# Altium project Single Teensy MD +interface+power@2025.PrjPcb
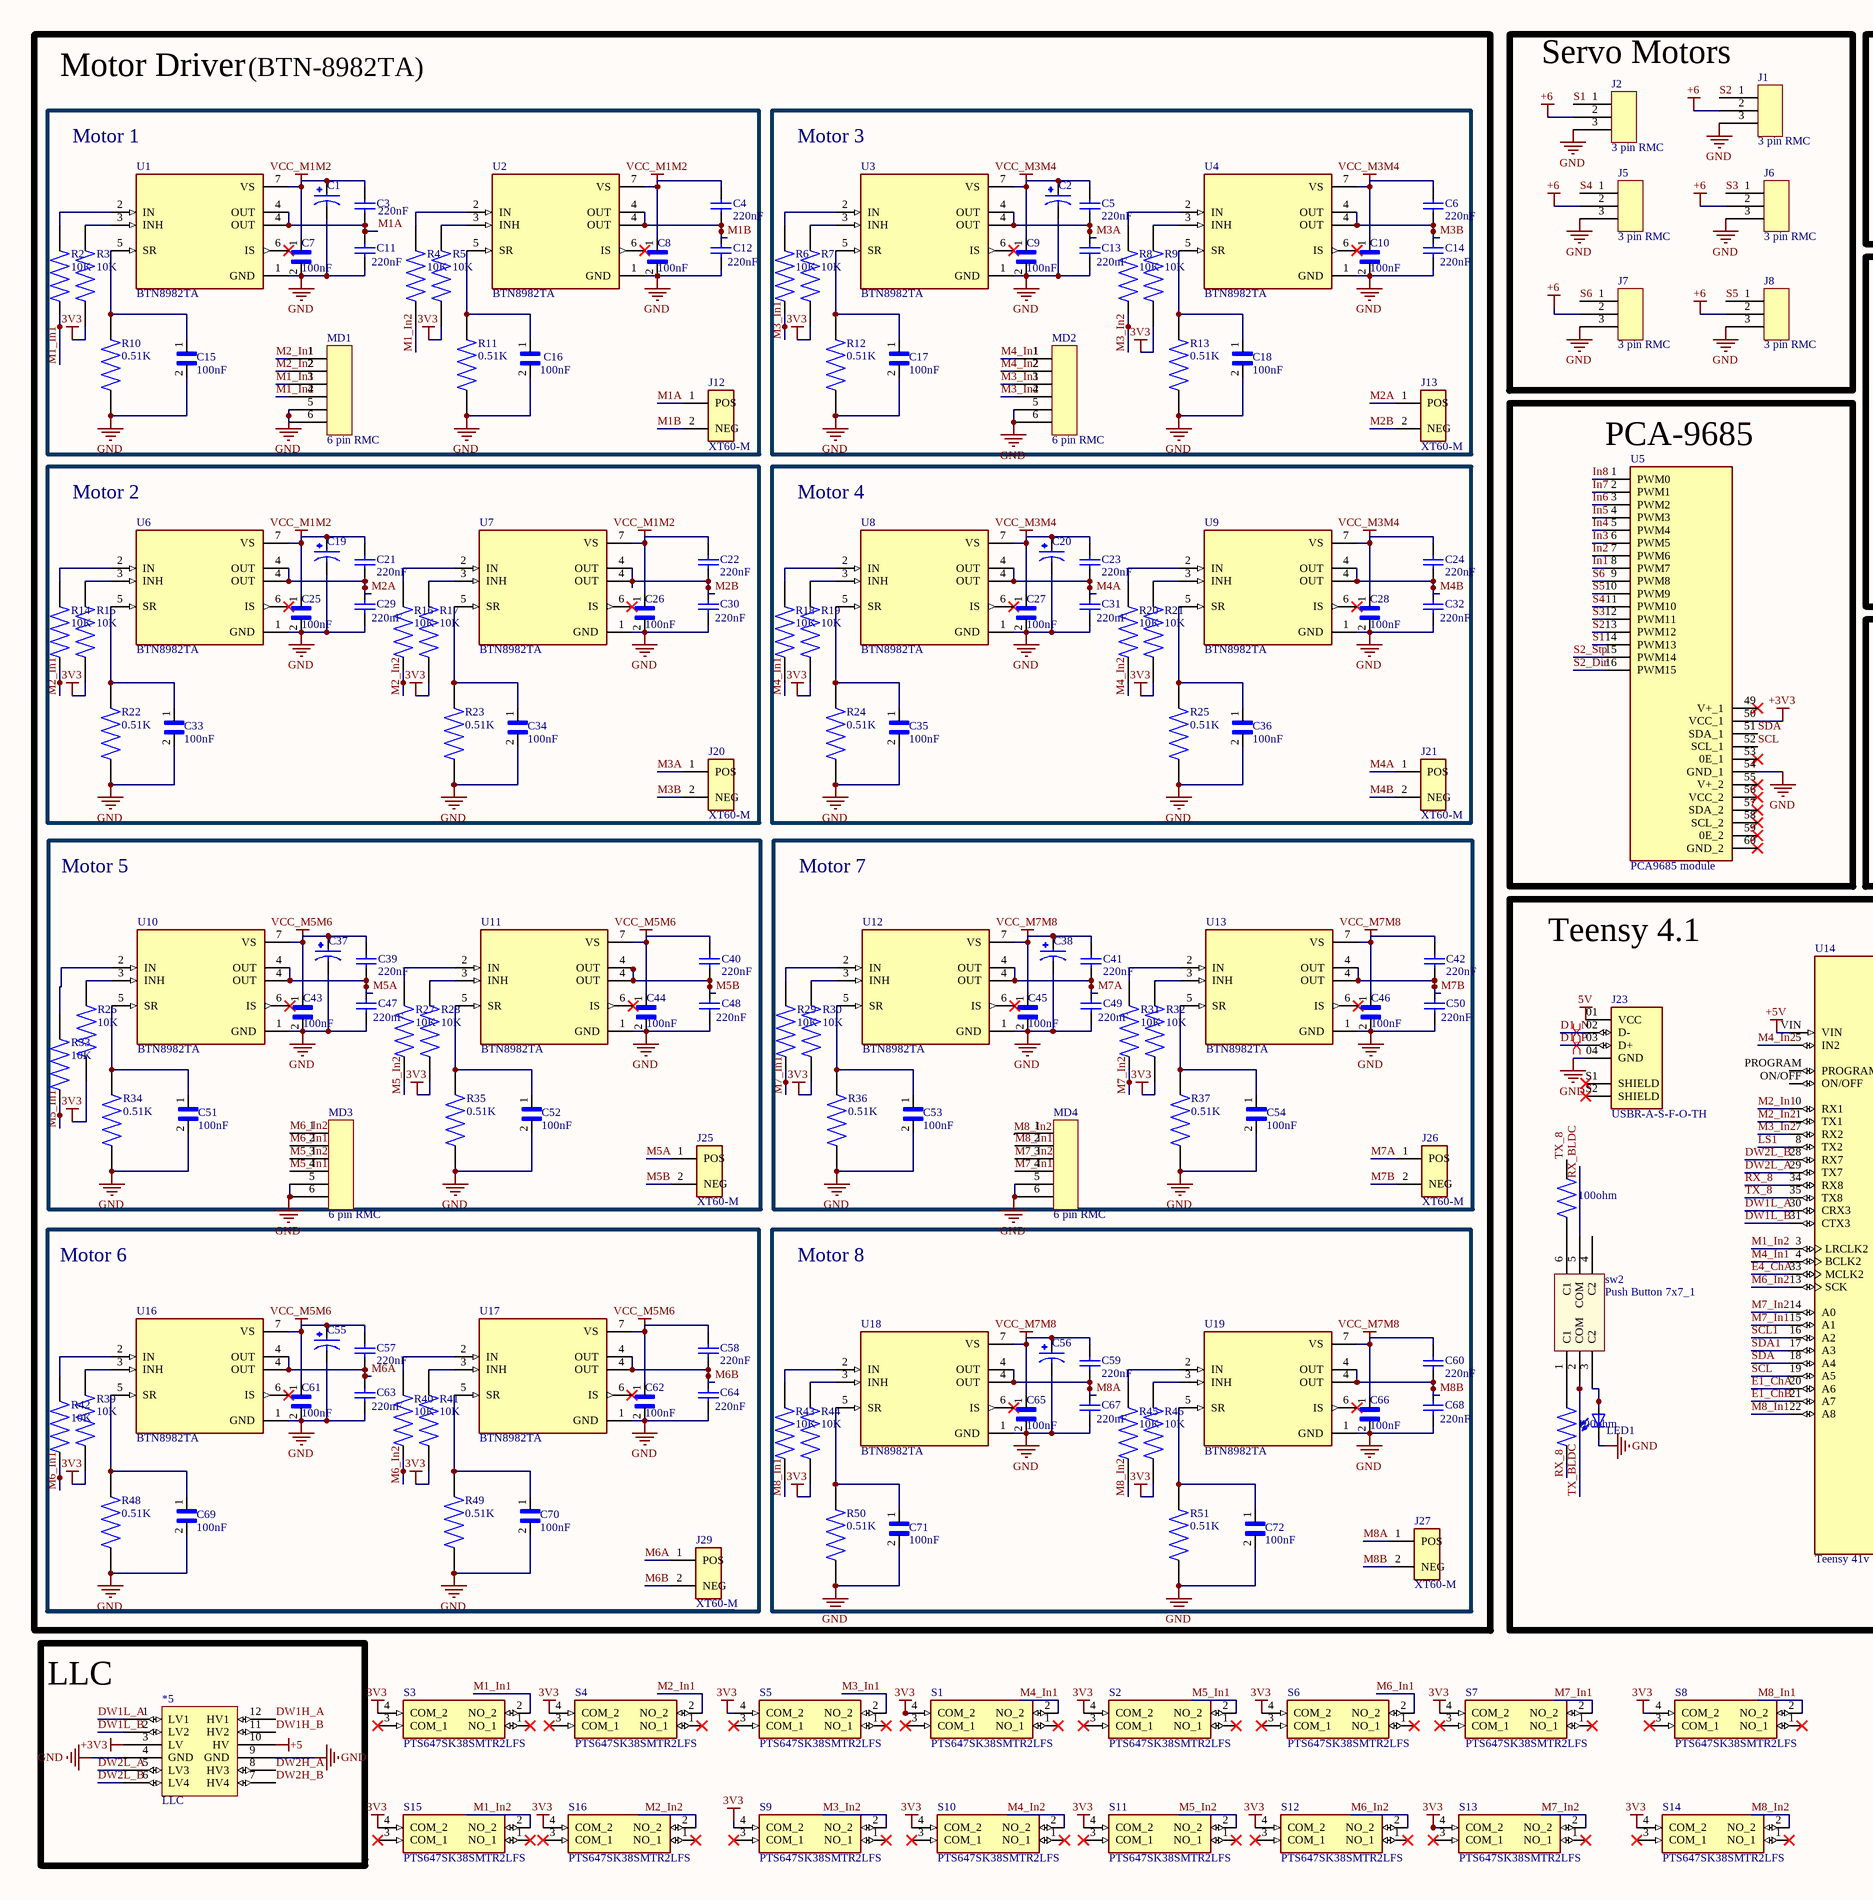
[diagram p0: Interface.SchDoc, left]
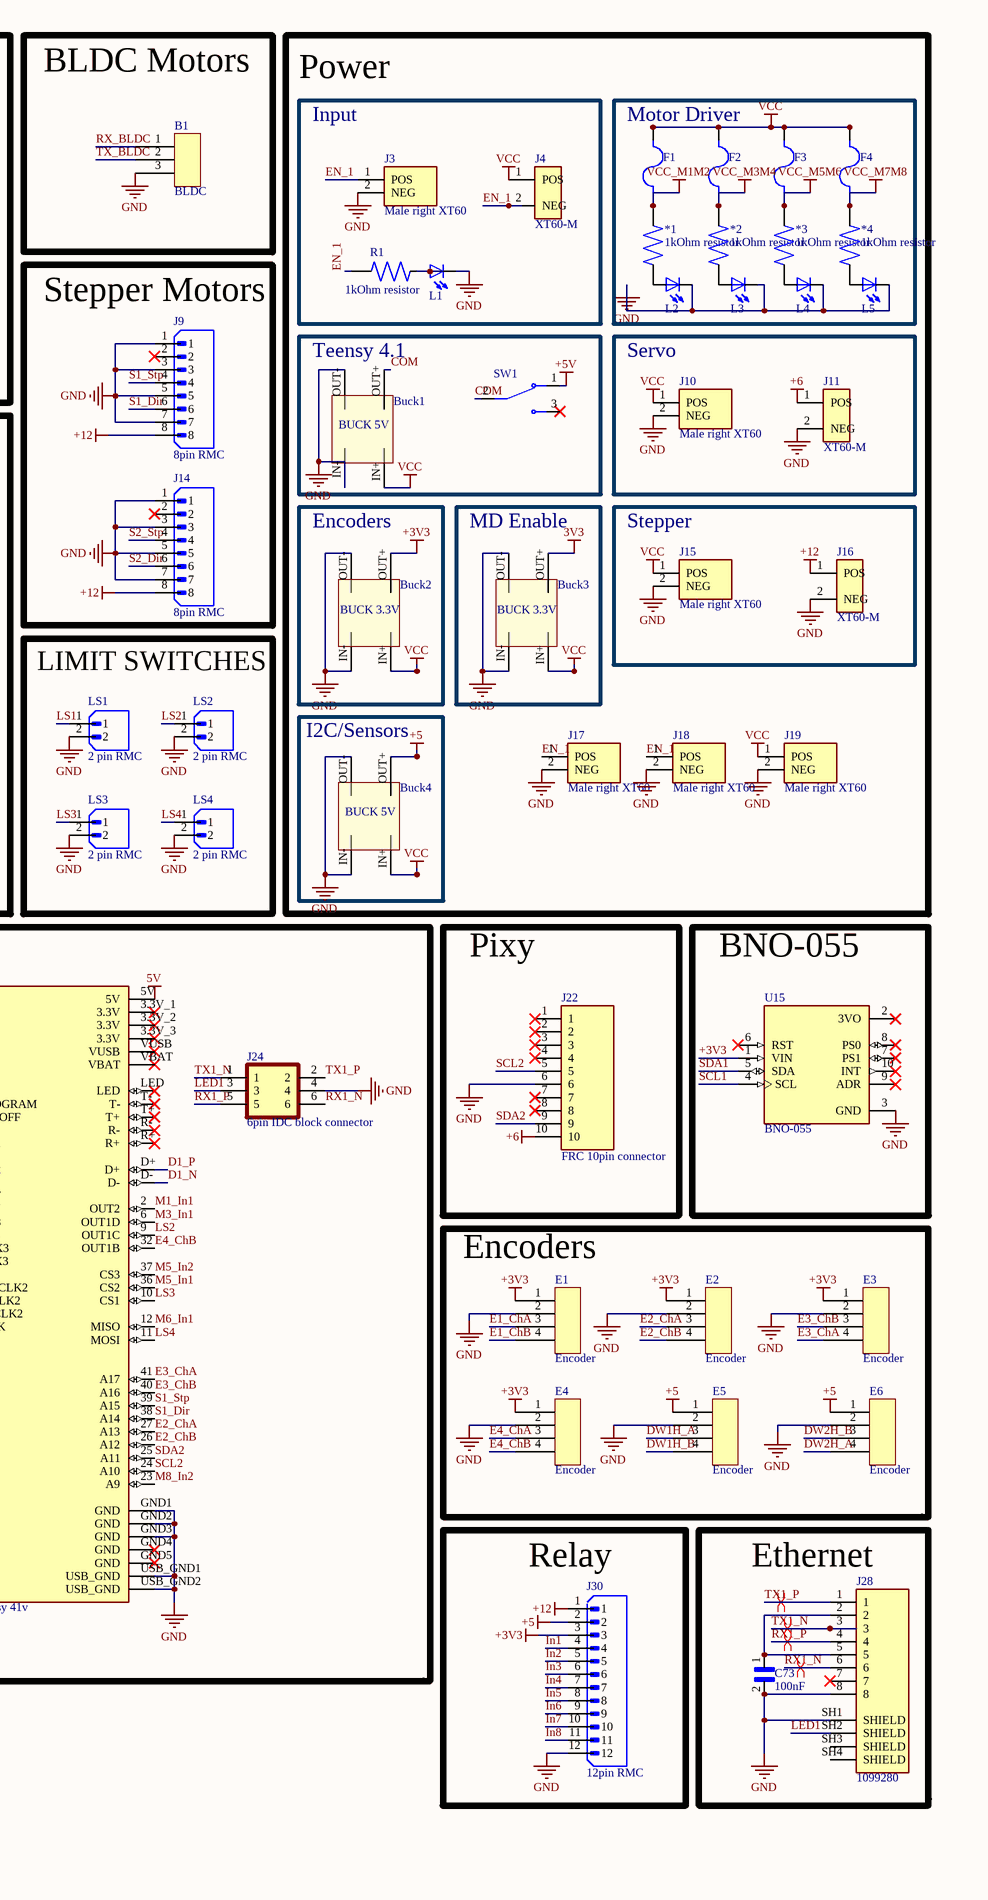
[diagram p1: Interface.SchDoc, right]
1 sheet, 225 parts. Net scope: global (net labels, ports and power ports of the same name join across sheets).
Board file: BOT1_2025.PcbDoc

## Sheet Interface.SchDoc: R1/R2 2025
size A2; Author: Mohammed; CompanyName: SRM Team Robocon; DrawnBy: Mohammed; SheetNumber: 1; SheetTotal: 1

### Parts
*1  1kOhm resistor  [1kOhm Resistor]
*2  1kOhm resistor  [1kOhm Resistor]
*3  1kOhm resistor  [1kOhm Resistor]
*4  1kOhm resistor  [1kOhm Resistor]
*5  LLC  [LLC]
B1  BLDC  [Header JST 1X03]
Buck1  CN3900 5V  [CN3903 Dubai buck 5V]  (value not drawn)
Buck2  CN3900 3.3V  [CN3903 Dubai buck 3.3V]  (value not drawn)
Buck3  CN3900 3.3V  [CN3903 Dubai buck 3.3V]  (value not drawn)
Buck4  CN3900 5V  [CN3903 Dubai buck 5V]  (value not drawn)
C1  1000uF 25V Capacitor  [1000uF 25V Capacitor]  (value not drawn)
C2  1000uF 25V Capacitor  [1000uF 25V Capacitor]  (value not drawn)
C3  220nF  [WCAP-CSST_0805_L2W1.25H1.25]
C4  220nF  [WCAP-CSST_0805_L2W1.25H1.25]
C5  220nF  [WCAP-CSST_0805_L2W1.25H1.25]
C6  220nF  [WCAP-CSST_0805_L2W1.25H1.25]
C7  100nF  [CAPC2012X88N]
C8  100nF  [CAPC2012X88N]
C9  100nF  [CAPC2012X88N]
C10  100nF  [CAPC2012X88N]
C11  220nF  [WCAP-CSST_0805_L2W1.25H1.25]
C12  220nF  [WCAP-CSST_0805_L2W1.25H1.25]
C13  220nF  [WCAP-CSST_0805_L2W1.25H1.25]
C14  220nF  [WCAP-CSST_0805_L2W1.25H1.25]
C15  100nF  [CAPC2012X88N]
C16  100nF  [CAPC2012X88N]
C17  100nF  [CAPC2012X88N]
C18  100nF  [CAPC2012X88N]
C19  1000uF 25V Capacitor  [1000uF 25V Capacitor]  (value not drawn)
C20  1000uF 25V Capacitor  [1000uF 25V Capacitor]  (value not drawn)
C21  220nF  [WCAP-CSST_0805_L2W1.25H1.25]
C22  220nF  [WCAP-CSST_0805_L2W1.25H1.25]
C23  220nF  [WCAP-CSST_0805_L2W1.25H1.25]
C24  220nF  [WCAP-CSST_0805_L2W1.25H1.25]
C25  100nF  [CAPC2012X88N]
C26  100nF  [CAPC2012X88N]
C27  100nF  [CAPC2012X88N]
C28  100nF  [CAPC2012X88N]
C29  220nF  [WCAP-CSST_0805_L2W1.25H1.25]
C30  220nF  [WCAP-CSST_0805_L2W1.25H1.25]
C31  220nF  [WCAP-CSST_0805_L2W1.25H1.25]
C32  220nF  [WCAP-CSST_0805_L2W1.25H1.25]
C33  100nF  [CAPC2012X88N]
C34  100nF  [CAPC2012X88N]
C35  100nF  [CAPC2012X88N]
C36  100nF  [CAPC2012X88N]
C37  1000uF 25V Capacitor  [1000uF 25V Capacitor]  (value not drawn)
C38  1000uF 25V Capacitor  [1000uF 25V Capacitor]  (value not drawn)
C39  220nF  [WCAP-CSST_0805_L2W1.25H1.25]
C40  220nF  [WCAP-CSST_0805_L2W1.25H1.25]
C41  220nF  [WCAP-CSST_0805_L2W1.25H1.25]
C42  220nF  [WCAP-CSST_0805_L2W1.25H1.25]
C43  100nF  [CAPC2012X88N]
C44  100nF  [CAPC2012X88N]
C45  100nF  [CAPC2012X88N]
C46  100nF  [CAPC2012X88N]
C47  220nF  [WCAP-CSST_0805_L2W1.25H1.25]
C48  220nF  [WCAP-CSST_0805_L2W1.25H1.25]
C49  220nF  [WCAP-CSST_0805_L2W1.25H1.25]
C50  220nF  [WCAP-CSST_0805_L2W1.25H1.25]
C51  100nF  [CAPC2012X88N]
C52  100nF  [CAPC2012X88N]
C53  100nF  [CAPC2012X88N]
C54  100nF  [CAPC2012X88N]
C55  1000uF 25V Capacitor  [1000uF 25V Capacitor]  (value not drawn)
C56  1000uF 25V Capacitor  [1000uF 25V Capacitor]  (value not drawn)
C57  220nF  [WCAP-CSST_0805_L2W1.25H1.25]
C58  220nF  [WCAP-CSST_0805_L2W1.25H1.25]
C59  220nF  [WCAP-CSST_0805_L2W1.25H1.25]
C60  220nF  [WCAP-CSST_0805_L2W1.25H1.25]
C61  100nF  [CAPC2012X88N]
C62  100nF  [CAPC2012X88N]
C63  220nF  [WCAP-CSST_0805_L2W1.25H1.25]
C64  220nF  [WCAP-CSST_0805_L2W1.25H1.25]
C65  100nF  [CAPC2012X88N]
C66  100nF  [CAPC2012X88N]
C67  220nF  [WCAP-CSST_0805_L2W1.25H1.25]
C68  220nF  [WCAP-CSST_0805_L2W1.25H1.25]
C69  100nF  [CAPC2012X88N]
C70  100nF  [CAPC2012X88N]
C71  100nF  [CAPC2012X88N]
C72  100nF  [CAPC2012X88N]
C73  100nF  [CAPC2012X88N]
E1  Encoder  [Header JST 1X04]
E2  Encoder  [Header JST 1X04]
E3  Encoder  [Header JST 1X04]
E4  Encoder  [Header JST 1X04]
E5  Encoder  [Header JST 1X04]
E6  Encoder  [Header JST 1X04]
F1  Blade Fuse Holder  [Blade fuse holder]  (value not drawn)
F2  Blade Fuse Holder  [Blade fuse holder]  (value not drawn)
F3  Blade Fuse Holder  [Blade fuse holder]  (value not drawn)
F4  Blade Fuse Holder  [Blade fuse holder]  (value not drawn)
J1  3 pin RMC  [Header JST 1X03]
J2  3 pin RMC  [Header JST 1X03]
J3  Male right XT60  [XT60M Right]
J4  XT60-M  [XT-60M]
J5  3 pin RMC  [Header JST 1X03]
J6  3 pin RMC  [Header JST 1X03]
J7  3 pin RMC  [Header JST 1X03]
J8  3 pin RMC  [Header JST 1X03]
J9  8pin RMC  [8pin RMC]
J10  Male right XT60  [XT60M Right]
J11  XT60-M  [XT60-M]
J12  XT60-M  [XT60-M]
J13  XT60-M  [XT60-M]
J14  8pin RMC  [8pin RMC]
J15  Male right XT60  [XT60M Right]
J16  XT60-M  [XT60-M]
J17  Male right XT60  [XT60M Right]
J18  Male right XT60  [XT60M Right]
J19  Male right XT60  [XT60M Right]
J20  XT60-M  [XT60-M]
J21  XT60-M  [XT60-M]
J22  FRC 10pin connector  [FRC 10pin Block connector]
J23  USBR-A-S-F-O-TH  [SAMTEC_USBR-A-S-F-O-TH]
J24  6pin IDC block connector  [6pin IDC block connector]
J25  XT60-M  [XT60-M]
J26  XT60-M  [XT60-M]
J27  XT60-M  [XT60-M]
J28  1099280  [PHOENIX_1099280]
J29  XT60-M  [XT60-M]
J30  12pin RMC  [Header JST 1X12]
L1  LED 3mm  [LED 3mm]  (value not drawn)
L2  LED 3mm  [LED 3mm]  (value not drawn)
L3  LED 3mm  [LED 3mm]  (value not drawn)
L4  LED 3mm  [LED 3mm]  (value not drawn)
L5  LED 3mm  [LED 3mm]  (value not drawn)
LED1  LED 3mm  [LED 3mm]  (value not drawn)
LS1  2 pin RMC  [JST 2 PIN]
LS2  2 pin RMC  [JST 2 PIN]
LS3  2 pin RMC  [JST 2 PIN]
LS4  2 pin RMC  [JST 2 PIN]
MD1  6 pin RMC  [HEADER JST 1X06]
MD2  6 pin RMC  [HEADER JST 1X06]
MD3  6 pin RMC  [HEADER JST 1X06]
MD4  6 pin RMC  [HEADER JST 1X06]
R1  1kOhm resistor  [1kOhm Resistor]
R2  10K  [RESC2012X65N]
R3  10K  [RESC2012X65N]
R4  10K  [RESC2012X65N]
R5  10K  [RESC2012X65N]
R6  10K  [RESC2012X65N]
R7  10K  [RESC2012X65N]
R8  10K  [RESC2012X65N]
R9  10K  [RESC2012X65N]
R10  0.51K  [RES_ERJHP6F5112V]
R11  0.51K  [RES_ERJHP6F5112V]
R12  0.51K  [RES_ERJHP6F5112V]
R13  0.51K  [RES_ERJHP6F5112V]
R14  10K  [RESC2012X65N]
R15  10K  [RESC2012X65N]
R16  10K  [RESC2012X65N]
R17  10K  [RESC2012X65N]
R18  10K  [RESC2012X65N]
R19  10K  [RESC2012X65N]
R20  10K  [RESC2012X65N]
R21  10K  [RESC2012X65N]
R22  0.51K  [RES_ERJHP6F5112V]
R23  0.51K  [RES_ERJHP6F5112V]
R24  0.51K  [RES_ERJHP6F5112V]
R25  0.51K  [RES_ERJHP6F5112V]
R26  10K  [RESC2012X65N]
R27  10K  [RESC2012X65N]
R28  10K  [RESC2012X65N]
R29  10K  [RESC2012X65N]
R30  10K  [RESC2012X65N]
R31  10K  [RESC2012X65N]
R32  10K  [RESC2012X65N]
R33  10K  [RESC2012X65N]
R34  0.51K  [RES_ERJHP6F5112V]
R35  0.51K  [RES_ERJHP6F5112V]
R36  0.51K  [RES_ERJHP6F5112V]
R37  0.51K  [RES_ERJHP6F5112V]
R38  100ohm  [1kOhm Resistor]
R39  10K  [RESC2012X65N]
R40  10K  [RESC2012X65N]
R41  10K  [RESC2012X65N]
R42  10K  [RESC2012X65N]
R43  10K  [RESC2012X65N]
R44  10K  [RESC2012X65N]
R45  10K  [RESC2012X65N]
R46  10K  [RESC2012X65N]
R47  100ohm  [1kOhm Resistor]
R48  0.51K  [RES_ERJHP6F5112V]
R49  0.51K  [RES_ERJHP6F5112V]
R50  0.51K  [RES_ERJHP6F5112V]
R51  0.51K  [RES_ERJHP6F5112V]
S1  PTS647SK38SMTR2LFS  [PTS647SK38SMTR2LFS]
S2  PTS647SK38SMTR2LFS  [PTS647SK38SMTR2LFS]
S3  PTS647SK38SMTR2LFS  [PTS647SK38SMTR2LFS]
S4  PTS647SK38SMTR2LFS  [PTS647SK38SMTR2LFS]
S5  PTS647SK38SMTR2LFS  [PTS647SK38SMTR2LFS]
S6  PTS647SK38SMTR2LFS  [PTS647SK38SMTR2LFS]
S7  PTS647SK38SMTR2LFS  [PTS647SK38SMTR2LFS]
S8  PTS647SK38SMTR2LFS  [PTS647SK38SMTR2LFS]
S9  PTS647SK38SMTR2LFS  [PTS647SK38SMTR2LFS]
S10  PTS647SK38SMTR2LFS  [PTS647SK38SMTR2LFS]
S11  PTS647SK38SMTR2LFS  [PTS647SK38SMTR2LFS]
S12  PTS647SK38SMTR2LFS  [PTS647SK38SMTR2LFS]
S13  PTS647SK38SMTR2LFS  [PTS647SK38SMTR2LFS]
S14  PTS647SK38SMTR2LFS  [PTS647SK38SMTR2LFS]
S15  PTS647SK38SMTR2LFS  [PTS647SK38SMTR2LFS]
S16  PTS647SK38SMTR2LFS  [PTS647SK38SMTR2LFS]
SW1  Slide Switch  [Slide Switch]  (value not drawn)
sw2  Push Button 7x7_1  [Push Button 7x7]
U1  BTN8982TA  [BTN8982 Motor driver]
U2  BTN8982TA  [BTN8982 Motor driver]
U3  BTN8982TA  [BTN8982 Motor driver]
U4  BTN8982TA  [BTN8982 Motor driver]
U5  PCA9685 module  [PCA9685 module]
U6  BTN8982TA  [BTN8982 Motor driver]
U7  BTN8982TA  [BTN8982 Motor driver]
U8  BTN8982TA  [BTN8982 Motor driver]
U9  BTN8982TA  [BTN8982 Motor driver]
U10  BTN8982TA  [BTN8982 Motor driver]
U11  BTN8982TA  [BTN8982 Motor driver]
U12  BTN8982TA  [BTN8982 Motor driver]
U13  BTN8982TA  [BTN8982 Motor driver]
U14  Teensy 41v  [Teensy 41v]
U15  BNO-055  [BNO-055]
U16  BTN8982TA  [BTN8982 Motor driver]
U17  BTN8982TA  [BTN8982 Motor driver]
U18  BTN8982TA  [BTN8982 Motor driver]
U19  BTN8982TA  [BTN8982 Motor driver]

### Blocks framed on the sheet
Motor Driver: C55 C57 C58 C61-C64 C69 C70 J29 R39-R42 R48 R49 U16 U17
Servo Motors: J1 J2 J5-J8
BLDC Motors: B1
Motor 1: C1 C3 C4 C7 C8 C11 C12 C15 C16 J12 MD1 R2-R5 R10 R11 U1 U2
Motor 3: C2 C5 C6 C9 C10 C13 C14 C17 C18 J13 MD2 R6-R9 R12 R13 U3 U4
Power: J3 J4 L1 R1
Stepper Motors: J9 J14
Teensy 4.1: Buck1 SW1
Servo: J10 J11
PCA-9685: U5
Motor 2: C19 C21 C22 C25 C26 C29 C30 C33 C34 J20 R14-R17 R22 R23 U6 U7
Motor 4: C20 C23 C24 C27 C28 C31 C32 C35 C36 J21 R18-R21 R24 R25 U8 U9
Encoders: Buck2
MD Enable: Buck3
Stepper: J15 J16
LIMIT SWITCHES: LS1-LS4
I2C/Sensors: Buck4
Motor 5: C37 C39 C40 C43 C44 C47 C48 C51 C52 J25 MD3 R26-R28 R33-R35 U10 U11
Motor 7: C38 C41 C42 C45 C46 C49 C50 C53 C54 J26 MD4 R29-R32 R36 R37 U12 U13
Teensy 4.1: J23 J24 LED1 R38 R47 sw2 U14
Pixy: J22
BNO-055: U15
Motor 8: C56 C59 C60 C65-C68 C71 C72 J27 R43-R46 R50 R51 U18 U19
Encoders: E1-E6
Relay: J30
Ethernet: C73 J28

### Nets
3V3: Buck3.OUT+ R3.1 R5.1 R7.1 R9.1 R15.1 R17.1 R19.1 R21.1 R26.1 R28.1 R30.1 R32.1 R39.1 R41.1 R44.1 R46.1 S1.4(COM_2) S2.4(COM_2) S3.4(COM_2) S4.4(COM_2) S5.4(COM_2) S6.4(COM_2) S7.4(COM_2) S8.4(COM_2) S9.4(COM_2) S10.4(COM_2) S11.4(COM_2) S12.4(COM_2) S13.4(COM_2) S14.4(COM_2) S15.4(COM_2) S16.4(COM_2)
5V: J23.01(VCC) U14.5V
+3V3: *5.3(LV) Buck2.OUT+ E1.1 E2.1 E3.1 E4.1 J30.3 U5.50(VCC_1) U15.1(VIN)
+5: *5.10(HV) Buck4.OUT+ E5.1 E6.1 J30.2
+5V: SW1.1(NC) U14.VIN
+6: J1.2 J2.2 J5.2 J6.2 J7.2 J8.2 J11.1(POS) J22.10
+12: J9.8 J14.8 J16.1(POS) J30.1
GND: *5.4(GND) *5.9(GND) B1.3 Buck1.IN- Buck1.OUT- Buck2.IN- Buck2.OUT- Buck3.IN- Buck3.OUT- Buck4.IN- Buck4.OUT- C1.N C2.N C7.2 C8.2 C9.2 C10.2 C11.1 C12.1 C13.1 C14.1 C15.2 C16.2 C17.2 C18.2 C19.N C20.N C25.2 C26.2 C27.2 C28.2 C29.1 C30.1 C31.1 C32.1 C33.2 C34.2 C35.2 C36.2 C37.N C38.N C43.2 C44.2 C45.2 C46.2 C47.1 C48.1 C49.1 C50.1 C51.2 C52.2 C53.2 C54.2 C55.N C56.N C61.2 C62.2 C63.1 C64.1 C65.2 C66.2 C67.1 C68.1 C69.2 C70.2 C71.2 C72.2 C73.2 E1.2 E2.2 E3.2 E4.2 E5.2 E6.2 J1.3 J2.3 J3.2(NEG) J5.3 J6.3 J7.3 J8.3 J9.1 J9.3 J9.5 J9.7 J10.2(NEG) J11.2(NEG) J14.1 J14.3 J14.5 J14.7 J15.2(NEG) J16.2(NEG) J17.2(NEG) J18.2(NEG) J19.2(NEG) J22.6 J23.04(GND) J24.4 J28.8 J28.SH1(SHIELD) J30.12 L1.K(C) L2.K(C) L3.K(C) L4.K(C) L5.K(C) LED1.K(C) LS1.2 LS2.2 LS3.2 LS4.2 MD1.5 MD1.6 MD2.5 MD2.6 MD3.5 MD3.6 MD4.5 MD4.6 R10.1 R11.1 R12.1 R13.1 R22.1 R23.1 R24.1 R25.1 R34.1 R35.1 R36.1 R37.1 R48.1 R49.1 R50.1 R51.1 U1.1(GND) U2.1(GND) U3.1(GND) U4.1(GND) U5.54(GND_1) U6.1(GND) U7.1(GND) U8.1(GND) U9.1(GND) U10.1(GND) U11.1(GND) U12.1(GND) U13.1(GND) U14.GND1(GND) U14.GND2(GND) U14.GND3(GND) U14.USB_GND1(USB_GND) U14.USB_GND2(USB_GND) U15.3(GND) U16.1(GND) U17.1(GND) U18.1(GND) U19.1(GND)
VCC: Buck1.IN+ Buck2.IN+ Buck3.IN+ Buck4.IN+ F1.1_1 F1.1_2 F2.1_1 F2.1_2 F3.1_1 F3.1_2 F4.1_1 F4.1_2 J4.1(POS) J10.1(POS) J15.1(POS) J19.1(POS)
VCC_M1M2: *1.1 C1.P C3.2 C4.2 C7.1 C8.1 C19.P C21.2 C22.2 C25.1 C26.1 F1.2_1 F1.2_2 U1.7(VS) U2.7(VS) U6.7(VS) U7.7(VS)
VCC_M3M4: *2.1 C2.P C5.2 C6.2 C9.1 C10.1 C20.P C23.2 C24.2 C27.1 C28.1 F2.2_1 F2.2_2 U3.7(VS) U4.7(VS) U8.7(VS) U9.7(VS)
VCC_M5M6: *3.1 C37.P C39.2 C40.2 C43.1 C44.1 C55.P C57.2 C58.2 C61.1 C62.1 F3.2_1 F3.2_2 U10.7(VS) U11.7(VS) U16.7(VS) U17.7(VS)
VCC_M7M8: *4.1 C38.P C41.2 C42.2 C45.1 C46.1 C56.P C59.2 C60.2 C65.1 C66.1 F4.2_1 F4.2_2 U12.7(VS) U13.7(VS) U18.7(VS) U19.7(VS)
COM: Buck1.OUT+ SW1.2(COM)
D1_N: J23.02(D-) U14.D-
D1_P: J23.03(D+) U14.D+
DW1H_A: *5.12(HV1) E5.3
DW1H_B: *5.11(HV2) E5.4
DW1L_A: *5.1(LV1) U14.30(CRX3)
DW1L_B: *5.2(LV2) U14.31(CTX3)
DW2H_A: *5.8(HV3) E6.4
DW2H_B: *5.7(HV4) E6.3
DW2L_A: *5.5(LV3) U14.29(TX7)
DW2L_B: *5.6(LV4) U14.28(RX7)
E1_ChA: E1.3 U14.20(A6)
E1_ChB: E1.4 U14.21(A7)
E2_ChA: E2.3 U14.27(A13)
E2_ChB: E2.4 U14.26(A12)
E3_ChA: E3.4 U14.41(A17)
E3_ChB: E3.3 U14.40(A16)
E4_ChA: E4.3 U14.33(MCLK2)
E4_ChB: E4.4 U14.32(OUT1B)
EN_1: J3.1(POS) J4.2(NEG) J17.1(POS) J18.1(POS) R1.2
In1: J30.4 U5.8(PWM7)
In2: J30.5 U5.7(PWM6)
In3: J30.6 U5.6(PWM5)
In4: J30.7 U5.5(PWM4)
In5: J30.8 U5.4(PWM3)
In6: J30.9 U5.3(PWM2)
In7: J30.10 U5.2(PWM1)
In8: J30.11 U5.1(PWM0)
LED1: J24.3 J28.SH2(SHIELD)
LS1: LS1.1 U14.8(TX2)
LS2: LS2.1 U14.9(OUT1C)
LS3: LS3.1 U14.10(CS1)
LS4: LS4.1 U14.11(MOSI)
M1_In1: MD1.3 R2.1 S3.2(NO_2) U14.2(OUT2)
M1_In2: MD1.4 R4.1 S15.2(NO_2) U14.3(LRCLK2)
M1A: C3.1 C11.2 J12.1(POS) U1.4(OUT)
M1B: C4.1 C12.2 J12.2(NEG) U2.4(OUT)
M2_In1: MD1.1 R14.1 S4.2(NO_2) U14.0(RX1)
M2_In2: MD1.2 R16.1 S16.2(NO_2) U14.1(TX1)
M2A: C21.1 C29.2 J13.1(POS) U6.4(OUT)
M2B: C22.1 C30.2 J13.2(NEG) U7.4(OUT)
M3_In1: MD2.3 R6.1 S5.2(NO_2) U14.6(OUT1D)
M3_In2: MD2.4 R8.1 S9.2(NO_2) U14.7(RX2)
M3A: C5.1 C13.2 J20.1(POS) U3.4(OUT)
M3B: C6.1 C14.2 J20.2(NEG) U4.4(OUT)
M4_In1: MD2.1 R18.1 S1.2(NO_2) U14.4(BCLK2)
M4_In2: MD2.2 R20.1 S10.2(NO_2) U14.5(IN2)
M4A: C23.1 C31.2 J21.1(POS) U8.4(OUT)
M4B: C24.1 C32.2 J21.2(NEG) U9.4(OUT)
M5_In1: MD3.4 R33.1 S2.2(NO_2) U14.36(CS2)
M5_In2: MD3.3 R27.1 S11.2(NO_2) U14.37(CS3)
M5A: C39.1 C47.2 J25.1(POS) U10.4(OUT)
M5B: C40.1 C48.2 J25.2(NEG) U11.4(OUT)
M6_In1: MD3.2 R42.1 S6.2(NO_2) U14.12(MISO)
M6_In2: MD3.1 R40.1 S12.2(NO_2) U14.13(SCK)
M6A: C57.1 C63.2 J29.1(POS) U16.4(OUT)
M6B: C58.1 C64.2 J29.2(NEG) U17.4(OUT)
M7_In1: MD4.4 R29.1 S7.2(NO_2) U14.15(A1)
M7_In2: MD4.3 R31.1 S13.2(NO_2) U14.14(A0)
M7A: C41.1 C49.2 J26.1(POS) U12.4(OUT)
M7B: C42.1 C50.2 J26.2(NEG) U13.4(OUT)
M8_In1: MD4.2 R43.1 S8.2(NO_2) U14.22(A8)
M8_In2: MD4.1 R45.1 S14.2(NO_2) U14.23(A9)
M8A: C59.1 C67.2 J27.1(POS) U18.4(OUT)
M8B: C60.1 C68.2 J27.2(NEG) U19.4(OUT)
RX1_N: J24.6 J28.6
RX1_P: J24.5 J28.4
RX_8: R47.2 U14.34(RX8)
RX_BLDC: B1.1 sw2.5(COM)
S1: J2.1 U5.14(PWM13)
S1_Dir: J9.6 U14.38(A14)
S1_Stp: J9.4 U14.39(A15)
S2: J1.1 U5.13(PWM12)
S2_Dir: J14.6 U5.16(PWM15)
S2_Stp: J14.4 U5.15(PWM14)
S3: J6.1 U5.12(PWM11)
S4: J5.1 U5.11(PWM10)
S5: J8.1 U5.10(PWM9)
S6: J7.1 U5.9(PWM8)
SCL: U5.52(SCL_1) U14.19(A5)
SCL1: U14.16(A2) U15.4(SCL)
SCL2: J22.5 U14.24(A10)
SDA: U5.51(SDA_1) U14.18(A4)
SDA1: U14.17(A3) U15.5(SDA)
SDA2: J22.9 U14.25(A11)
TX1_N: J24.1 J28.3
TX1_P: J24.2 J28.1
TX_8: R38.2 U14.35(TX8)
TX_BLDC: B1.2 sw2.2(COM)
Net*1_2: *1.2 L2.A
Net*2_2: *2.2 L3.A
Net*3_2: *3.2 L4.A
Net*4_2: *4.2 L5.A
NetC15_1: C15.1 R10.2 U1.5(SR)
NetC16_1: C16.1 R11.2 U2.5(SR)
NetC17_1: C17.1 R12.2 U3.5(SR)
NetC18_1: C18.1 R13.2 U4.5(SR)
NetC33_1: C33.1 R22.2 U6.5(SR)
NetC34_1: C34.1 R23.2 U7.5(SR)
NetC35_1: C35.1 R24.2 U8.5(SR)
NetC36_1: C36.1 R25.2 U9.5(SR)
NetC51_1: C51.1 R34.2 U10.5(SR)
NetC52_1: C52.1 R35.2 U11.5(SR)
NetC53_1: C53.1 R36.2 U12.5(SR)
NetC54_1: C54.1 R37.2 U13.5(SR)
NetC69_1: C69.1 R48.2 U16.5(SR)
NetC70_1: C70.1 R49.2 U17.5(SR)
NetC71_1: C71.1 R50.2 U18.5(SR)
NetC72_1: C72.1 R51.2 U19.5(SR)
NetC73_1: C73.1 J28.2 J28.5
NetL1_A: L1.A R1.1
NetLED1_A: LED1.A sw2.3(C2)
NetR2_2: R2.2 U1.2(IN)
NetR3_2: R3.2 U1.3(INH)
NetR4_2: R4.2 U2.2(IN)
NetR5_2: R5.2 U2.3(INH)
NetR6_2: R6.2 U3.2(IN)
NetR7_2: R7.2 U3.3(INH)
NetR8_2: R8.2 U4.2(IN)
NetR9_2: R9.2 U4.3(INH)
NetR14_2: R14.2 U6.2(IN)
NetR15_2: R15.2 U6.3(INH)
NetR16_2: R16.2 U7.2(IN)
NetR17_2: R17.2 U7.3(INH)
NetR18_2: R18.2 U8.2(IN)
NetR19_2: R19.2 U8.3(INH)
NetR20_2: R20.2 U9.2(IN)
NetR21_2: R21.2 U9.3(INH)
NetR26_2: R26.2 U10.3(INH)
NetR27_2: R27.2 U11.2(IN)
NetR28_2: R28.2 U11.3(INH)
NetR29_2: R29.2 U12.2(IN)
NetR30_2: R30.2 U12.3(INH)
NetR31_2: R31.2 U13.2(IN)
NetR32_2: R32.2 U13.3(INH)
NetR33_2: R33.2 U10.2(IN)
NetR38_1: R38.1 sw2.6(C1)
NetR39_2: R39.2 U16.3(INH)
NetR40_2: R40.2 U17.2(IN)
NetR41_2: R41.2 U17.3(INH)
NetR42_2: R42.2 U16.2(IN)
NetR43_2: R43.2 U18.2(IN)
NetR44_2: R44.2 U18.3(INH)
NetR45_2: R45.2 U19.2(IN)
NetR46_2: R46.2 U19.3(INH)
NetR47_1: R47.1 sw2.1(C1)

Not connected (* = marked no-connect by the designer): J9 2*; J14 2*; J22 1* 2* 3* 4* 7* 8*; J23 S1(SHIELD)* S2(SHIELD)*; J28 7* SH3(SHIELD) SH4(SHIELD); S1 1(NO_1)* 3(COM_1)*; S2 1(NO_1)* 3(COM_1)*; S3 1(NO_1)* 3(COM_1)*; S4 1(NO_1)* 3(COM_1)*; S5 1(NO_1)* 3(COM_1)*; S6 1(NO_1)* 3(COM_1)*; S7 1(NO_1)* 3(COM_1)*; S8 1(NO_1)* 3(COM_1)*; S9 1(NO_1)* 3(COM_1)*; S10 1(NO_1)* 3(COM_1)*; S11 1(NO_1)* 3(COM_1)*; S12 1(NO_1)* 3(COM_1)*; S13 1(NO_1)* 3(COM_1)*; S14 1(NO_1)* 3(COM_1)*; S15 1(NO_1)* 3(COM_1)*; S16 1(NO_1)* 3(COM_1)*; SW1 3(NO)*; sw2 4(C2); U1 6(IS)*; U2 6(IS)*; U3 6(IS)*; U4 6(IS)*; U5 49(V+_1)* 53(0E_1)* 55(V+_2)* 56(VCC_2)* 57(SDA_2)* 58(SCL_2)* 59(0E_2)* 60(GND_2)*; U6 6(IS)*; U7 6(IS)*; U8 6(IS)*; U9 6(IS)*; U10 6(IS)*; U11 6(IS)*; U12 6(IS)*; U13 6(IS)*; U14 3.3V_1(3.3V)* 3.3V_2(3.3V)* 3.3V_3(3.3V)* GND4(GND)* GND5(GND)* LED* ON/OFF PROGRAM R+* R-* T+* T-* VBAT* VUSB*; U15 2(3VO)* 6(RST)* 7(PS1)* 8(PS0)* 9(ADR)* 10(INT)*; U16 6(IS)*; U17 6(IS)*; U18 6(IS)*; U19 6(IS)*

### Layout directives
differential pair: D1_N, D1_P, RX1_N, RX1_P, TX1_N, TX1_P

### Notes on the sheet
- (BTN-8982TA)
- Input
- Motor Driver
- Motor 6
- LLC
- (in symbol CN3900 3.3V) BUCK 3.3V
- (in symbol CN3900 5V) BUCK 5V

### Library data of the parts
B1 = 3 pin RMC
C1 C2 C19 C20 C37 C38 C55 C56 = 1000uF 25V Capacitor: CAP ALUM 1000UF 20% 25V RADIAL; MP: EEUTA1E102LB; MF: Panasonic; Package: RADIAL-2 Panasonic; Availability: No availability data; Price: None; Check_prices: https://www.snapeda.com/parts/EEUTA1E102LB/Panasonic/view-part/5789306/?ref=eda; SnapEDA_Link: https://www.snapeda.com/parts/EEUTA1E102LB/Panasonic/view-part/5789306/?ref=snap; Value: *
C3-C6 C11-C14 C21-C24 C29-C32 C39-C42 C47-C50 C57-C60 C63 C64 C67 C68 = 885382207008: WCAP-CSST Multilayer Ceramic Chip Capacitor, Soft Termination, SMT, size 0805, X7R Class II, 220nF, 50V; Manufacturer: Wurth Elektronik; Case/Size Code: 0805; Capacitance Tolerance: +/-10%; Dissipation Factor: 3%; Insulation Resistance: 2.3GOhm; Technical Reference: X7R0805224K050DFCT1S000; Manufacturer Part Number: 885382207008; Category: Multilayer Ceramic Chip Capacitors; Match Code: WCAP-CSST; ComponentLink1Description: Website Link; ComponentLink1URL: https://www.we-online.com/redexpert/article/885382207008?ad; ComponentLink2Description: Datasheet Link; ComponentLink2URL: https://www.we-online.com/redexpert/spec/885382207008?ad; Mount: Surface Mount; Operating Temperature Max: 125°C; Operating Temperature Min: -55°C; Packaging: Tape and Reel; Length: 2mm; Width: 1.25mm; Height: 1.25mm; Capacitance: 220nF; Ceramic Type: X7R Class II; Rated Voltage (DC): 50V
C7-C10 C15-C18 C25-C28 C33-C36 C43-C46 C51-C54 C61 C62 C65 C66 C69-C73 = C0805F104K5RACTU: 0.1ÂµF Â±10% 50V Ceramic Capacitor X7R 0805 _2012 Metric_; MF: KEMET; Package: 0805 KEMET; Digi-Key_Part_Number: 399-5110-1-ND; MP: C0805F104K5RACTU; Digi-Key_Purchase_URL: https://www.digikey.com.mx/product-detail/en/kemet/C0805F104K5RACTU/399-5110-1-ND/1465635?utm_source=snapeda&utm_medium=aggregator&utm_campaign=symbol; SnapEDA_Link: https://www.snapeda.com/parts/C0805F104K5RACTU/KEMET/view-part/982423/?ref=snap; Value: *
E1-E6 = 4 pin RMC
J3 J10 J15 J17-J19 = XT60M Right
J4 = XT60-M_1: Plug; DC supply; XT60; male; PIN: 2; for cable; soldered; 30A; 500V; MF: AMASS; MP: XT60-M; Price: None; Package: Package Analog Devices; Value: *; Availability: Unavailable; SnapEDA_Link: https://www.snapeda.com/parts/XT60-M/AMASS/view-part/2883912/?ref=snap
J9 J14 = 8pin RMC: 8 pin RMC
J11-J13 J16 J20 J21 J25-J27 J29 = XT60-M: Plug; DC supply; XT60; male; PIN: 2; for cable; soldered; 30A; 500V; MF: AMASS; MP: XT60-M; Price: None; Package: Package Analog Devices; Value: *; Availability: Unavailable; SnapEDA_Link: https://www.snapeda.com/parts/XT60-M/AMASS/view-part/2883912/?ref=snap
J22 = FRC 10pin connector: Conn Shrouded Header HDR 10 POS 2.54mm Solder ST Thru-Hole Tray; MP: 1761681-3; MF: TE Connectivity; Availability: Unavailable; SnapEDA_Link: https://www.snapeda.com/parts/1761681-3/TE%20Connectivity%20AMP%20Connectors/view-part/494554/?ref=snap; Price: None; Package: None; Value: *
J23 = USBR-A-S-F-O-TH: USB-A _USB TYPE-A_ USB 2.0 Receptacle Connector 4 Position Through Hole, Right Angle; MF: Samtec; SnapEDA_Link: https://www.snapeda.com/parts/USBR-A-S-F-O-TH/Samtec%20Inc./view-part/932528/?ref=snap; Value: *; Toby_UK-Purchase-URL: https://snapeda.com/shop?store=Toby+UK&id=932528; MP: USBR-A-S-F-O-TH; Package: None; DigiKey-Purchase-URL: https://snapeda.com/shop?store=DigiKey&id=932528; Price: None; Availability: Unavailable
J24 = 6pin IDC block connector: AMP-LATCH 6 Position 2.54 mm Dual Row Through-Hole Straight Pin Header; Number_of_Positions: 6; MP: 2-1761603-1; MF: TE Connectivity; Centerline_Pitch: 2.54 mm[.1 in]; EU_RoHS_Compliance: Compliant; Purchase-URL: https://pricing.snapeda.com/search/part/2-1761603-1/?ref=eda; SnapEDA_Link: https://www.snapeda.com/parts/2-1761603-1/TE%20Connectivity%20AMP%20Connectors/view-part/519592/?ref=snap; Price: None; Package: None; Value: *; Check_prices: https://www.snapeda.com/parts/2-1761603-1/TE%20Connectivity%20AMP%20Connectors/view-part/519592/?ref=eda; Product_Type: Connector; Availability: Good
J28 = 1099280: RJ45 Ethernet port; Package: None; Price: None; Value: *; MP: 1099280; Availability: Unavailable
J30 = 12pin RMC: 12 pin RMC
LS1-LS4 = 2 pin RMC: Connector Header Through Hole 2 position 0.098 (2.50mm) JST; MF: JST Sales America Inc.; MP: B2B-XH-A(LF)(SN); SnapEDA_Link: https://www.snapeda.com/parts/B2B-XH-A(LF)(SN)/JST+Sales+America+Inc./view-part/?ref=snap; Package: None; Value: *; Check_prices: https://www.snapeda.com/parts/B2B-XH-A(LF)(SN)/JST+Sales+America+Inc./view-part/?ref=eda
R2-R9 R14-R21 R26-R33 R39-R46 = RMCF0805FT10K0: 10k ohm 0805 smd resistor; MF: {'manufacturer': u'Stackpole Electronics Inc'}; Package: None; Price: None; Value: *; MP: RMCF0805FT10K0; Availability: Unavailable
R10-R13 R22-R25 R34-R37 R48-R51 = ERJHP6F5112V: 0805 0.51k ohm; Availability: Unavailable; Price: None; Package: None; MP: ERJHP6F5112V; Value: *
R38 R47 = 1kOhm resistor
S1-S16 = PTS647SK38SMTR2LFS: Tactile Switch SPST-NO Top Actuated Surface Mount; MF: C&K; SnapEDA_Link: https://www.snapeda.com/parts/PTS%20647%20SK38%20SMTR2%20LFS/C%2526K/view-part/?ref=snap; Package: None; Value: *; MP: PTS 647 SK38 SMTR2 LFS; Check_prices: https://www.snapeda.com/parts/PTS%20647%20SK38%20SMTR2%20LFS/C%2526K/view-part/?ref=eda
U1-U4 U6-U13 U16-U19 = BTN8982TA: Motor / Motion / Ignition Controllers & Drivers TRILITH IC / NOVALITH IC; MF: Infineon Technologies; Price: None; Availability: In Stock; MP: BTN8982TA; Package: TO-263-8 Infineon Technologies; SnapEDA_Link: https://www.snapeda.com/parts/BTN8982TA/Infineon+Technologies/view-part/?ref=snap; Check_prices: https://www.snapeda.com/parts/BTN8982TA/Infineon+Technologies/view-part/?ref=eda; Value: *; Purchase-URL: https://pricing.snapeda.com/search/part/BTN8982TA/?ref=eda
U5 = PCA9685 module: Undefined or Miscellaneous; Manufacturer_Name: Adafruit; Manufacturer_Part_Number: 815; Datasheet Link: https://cdn-shop.adafruit.com/datasheets/PCA9685.pdf; Mouser Part Number: 485-815; Mouser Price/Stock: https://www.mouser.co.uk/ProductDetail/Adafruit/815?qs=GURawfaeGuCGKbWyy9179Q%3D%3D; Arrow Part Number: 815; Arrow Price/Stock: https://www.arrow.com/en/products/815/adafruit-industries?region=nac
U14 = Teensy 41v: RT1062 Teensy 4.1 series ARMÂ® CortexÂ®-M7 MPU Embedded Evaluation Board; MP: DEV-16771; MF: SparkFun Electronics; Check_prices: https://www.snapeda.com/parts/DEV-16771/SparkFun+Electronics/view-part/?ref=eda; Value: *; Availability: In Stock; Price: None; Package: None; SnapEDA_Link: https://www.snapeda.com/parts/DEV-16771/SparkFun+Electronics/view-part/?ref=snap; Purchase-URL: https://pricing.snapeda.com/search/part/DEV-16771/?ref=eda
U15 = BNO-055: Adafruit 9-DOF Absolute Orientation IMU Fusion Breakout - BNO055 | Adafruit Industries 2472; MP: 2472; SnapEDA_Link: https://www.snapeda.com/parts/2472/Adafruit+Industries/view-part/?ref=snap; Package: Non-Standard Adafruit; Value: *; MF: Adafruit; Check_prices: https://www.snapeda.com/parts/2472/Adafruit+Industries/view-part/?ref=eda